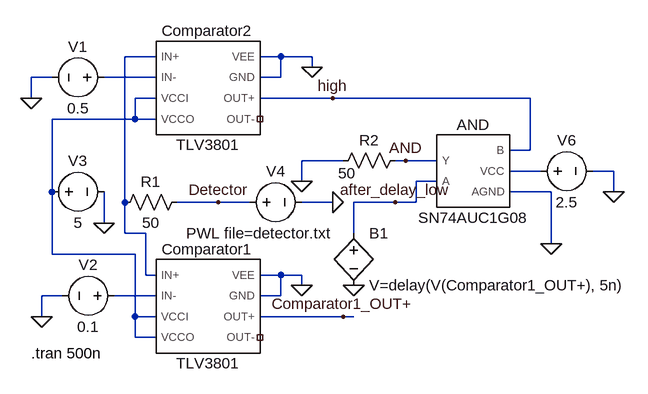
[diagram p0: schematic double-threshold-discriminator.asc]
double-threshold-discriminator.asc, the LTspice schematic file:
Version 4.1
SHEET 1 880 680
WIRE -96 -112 -144 -112
WIRE 96 -112 64 -112
WIRE 144 -112 96 -112
WIRE 144 -96 144 -112
WIRE -256 -80 -288 -80
WIRE -96 -80 -176 -80
WIRE 96 -80 96 -112
WIRE 96 -80 64 -80
WIRE -288 -48 -288 -80
WIRE -96 -48 -128 -48
WIRE 176 -48 64 -48
WIRE 480 -48 176 -48
WIRE -128 -16 -128 -48
WIRE -128 -16 -256 -16
WIRE -96 -16 -128 -16
WIRE 480 32 480 -48
WIRE 480 32 448 32
WIRE 192 48 128 48
WIRE 288 48 272 48
WIRE 336 48 288 48
WIRE 496 64 448 64
WIRE 608 64 576 64
WIRE 128 80 128 48
WIRE 336 80 304 80
WIRE -256 96 -256 -16
WIRE 512 96 448 96
WIRE 608 96 608 64
WIRE -144 112 -144 -112
WIRE 0 112 -64 112
WIRE 48 112 0 112
WIRE 176 112 128 112
WIRE 272 112 208 112
WIRE 304 112 304 80
WIRE 304 112 272 112
WIRE -176 144 -176 96
WIRE -144 160 -144 112
WIRE -112 160 -144 160
WIRE 208 160 208 112
WIRE 512 176 512 96
WIRE -256 192 -256 96
WIRE -128 192 -256 192
WIRE -112 224 -112 160
WIRE -96 224 -112 224
WIRE 96 224 64 224
WIRE 128 224 96 224
WIRE 128 240 128 224
WIRE -240 256 -272 256
WIRE -96 256 -160 256
WIRE 96 256 96 224
WIRE 96 256 64 256
WIRE -272 288 -272 256
WIRE -128 288 -128 192
WIRE -96 288 -128 288
WIRE 192 288 64 288
WIRE 208 288 192 288
WIRE -128 320 -128 288
WIRE -96 320 -128 320
FLAG -288 -48 0
FLAG -176 144 0
FLAG -272 288 0
FLAG 176 112 0
FLAG 512 176 0
FLAG 608 96 0
FLAG 128 80 0
FLAG 144 -96 0
FLAG 128 240 0
FLAG 208 240 0
FLAG 288 48 AND
FLAG 192 288 Comparator1_OUT+
FLAG 0 112 Detector
FLAG 272 112 after_delay_low
FLAG 176 -48 high
SYMBOL SN74AUC1G08 384 64 R0
SYMATTR InstName AND
SYMBOL TLV3801 -16 -64 R0
SYMATTR InstName Comparator2
SYMBOL TLV3801 -16 272 R0
SYMATTR InstName Comparator1
SYMBOL voltage -160 -80 R90
WINDOW 0 -32 56 VBottom 2
WINDOW 3 32 56 VTop 2
WINDOW 123 0 0 Left 0
WINDOW 39 0 0 Left 0
SYMATTR InstName V1
SYMATTR Value 0.5
SYMBOL voltage -144 256 R90
WINDOW 0 -32 56 VBottom 2
WINDOW 3 32 56 VTop 2
WINDOW 123 0 0 Left 0
WINDOW 39 0 0 Left 0
SYMATTR InstName V2
SYMATTR Value 0.1
SYMBOL voltage -272 96 R270
WINDOW 0 32 56 VTop 2
WINDOW 3 -32 56 VBottom 2
WINDOW 123 0 0 Left 0
WINDOW 39 0 0 Left 0
SYMATTR InstName V3
SYMATTR Value 5
SYMBOL voltage 32 112 R270
WINDOW 0 32 56 VTop 2
WINDOW 3 -32 30 VBottom 2
WINDOW 123 0 0 Left 0
WINDOW 39 0 0 Left 0
SYMATTR InstName V4
SYMATTR Value PWL file=detector.txt
SYMBOL voltage 480 64 R270
WINDOW 0 32 56 VTop 2
WINDOW 3 -32 56 VBottom 2
WINDOW 123 0 0 Left 0
WINDOW 39 0 0 Left 0
SYMATTR InstName V6
SYMATTR Value 2.5
SYMBOL res -48 96 R90
WINDOW 0 0 56 VBottom 2
WINDOW 3 32 56 VTop 2
SYMATTR InstName R1
SYMATTR Value 50
SYMBOL res 288 32 R90
WINDOW 0 0 56 VBottom 2
WINDOW 3 20 90 VTop 2
SYMATTR InstName R2
SYMATTR Value 50
SYMBOL bv 208 144 R0
SYMATTR InstName B1
SYMATTR Value V=delay(V(Comparator1_OUT+), 5n)
TEXT -288 344 Left 2 !.tran 500n

The netlist it stands for:
* double-threshold-discriminator.asc
X§AND AND after_delay_low high N004 0 SN74AUC1G08  ; pins Y A B VCC AGND
X§Comparator2 N001 N002 N003 N003 0 0 high NC_01 TLV3801  ; pins IN+ IN- VCCI VCCO VEE GND OUT+ OUT-
X§Comparator1 N001 N005 N003 N003 0 0 Comparator1_OUT+ NC_02 TLV3801  ; pins IN+ IN- VCCI VCCO VEE GND OUT+ OUT-
V1 N002 0 0.5
V2 N005 0 0.1
V3 N003 0 5
V4 Detector 0 PWL file=detector.txt
V6 N004 0 2.5
R1 Detector N001 50
R2 AND 0 50
B1 after_delay_low 0 V=delay(V(Comparator1_OUT+), 5n)
.tran 500n
.lib SN74AUC1G08.cir
.lib tlv3801.lib
.backanno
.end